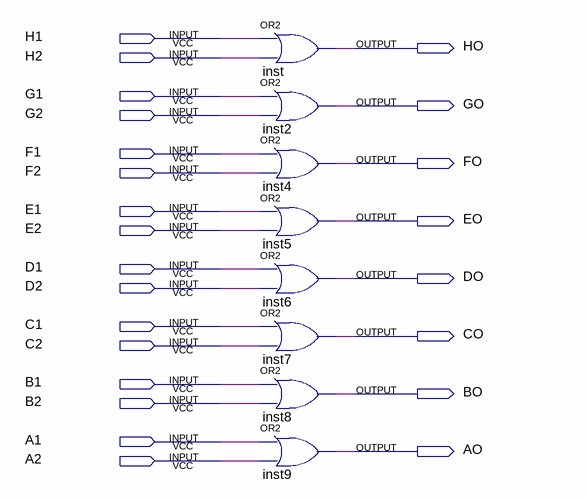
[diagram p0: schematic sheet]
// Quartus schematic OR.bdf as structural Verilog: 8 symbols, 24 pins
module OR (
  input  H1,
  input  H2,
  input  G1,
  input  G2,
  input  F1,
  input  F2,
  input  E1,
  input  E2,
  input  D1,
  input  D2,
  input  C1,
  input  C2,
  input  B1,
  input  B2,
  input  A1,
  input  A2,
  output HO,
  output GO,
  output FO,
  output EO,
  output DO,
  output CO,
  output BO,
  output AO
);

  or inst (HO, H1, H2);
  or inst2 (GO, G1, G2);
  or inst4 (FO, F1, F2);
  or inst5 (EO, E1, E2);
  or inst6 (DO, D1, D2);
  or inst7 (CO, C1, C2);
  or inst8 (BO, B1, B2);
  or inst9 (AO, A1, A2);
endmodule
